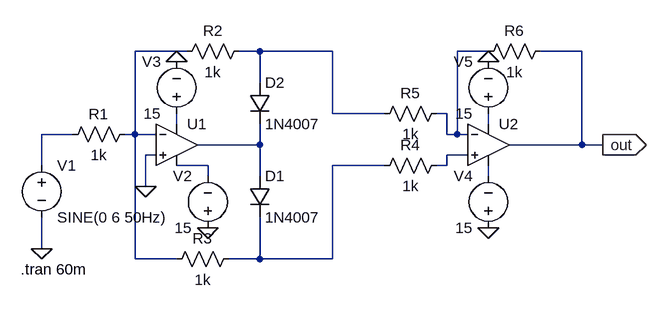
[diagram p0: schematic Day9_Precision_Full_wave_recitifer.asc]
Day9_Precision_Full_wave_recitifer.asc, the LTspice schematic file:
Version 4.1
SHEET 1 880 680
WIRE 80 16 0 16
WIRE 192 16 160 16
WIRE 304 16 192 16
WIRE 544 16 496 16
WIRE 688 16 624 16
WIRE 192 64 192 16
WIRE 304 112 304 16
WIRE 384 112 304 112
WIRE 480 112 464 112
WIRE 64 128 64 112
WIRE 544 128 544 112
WIRE -96 144 -144 144
WIRE 0 144 0 16
WIRE 0 144 -16 144
WIRE 32 144 0 144
WIRE 480 144 480 112
WIRE 496 144 496 16
WIRE 496 144 480 144
WIRE 512 144 496 144
WIRE 192 160 192 128
WIRE 192 160 96 160
WIRE 688 160 688 16
WIRE 688 160 576 160
WIRE 720 160 688 160
WIRE 32 176 16 176
WIRE 512 176 480 176
WIRE -144 192 -144 144
WIRE 112 192 64 192
WIRE 384 192 304 192
WIRE 480 192 480 176
WIRE 480 192 464 192
WIRE 112 208 112 192
WIRE 192 208 192 160
WIRE 544 208 544 192
WIRE 16 224 16 176
WIRE -144 320 -144 272
WIRE 0 336 0 144
WIRE 64 336 0 336
WIRE 192 336 192 272
WIRE 192 336 144 336
WIRE 304 336 304 192
WIRE 304 336 192 336
FLAG 720 160 out
IOPIN 720 160 Out
FLAG 112 288 0
FLAG 64 32 0
FLAG 544 288 0
FLAG 544 32 0
FLAG -144 320 0
FLAG 16 224 0
SYMBOL OpAmps\\UniversalOpAmp2 64 160 R0
SYMATTR InstName U1
SYMBOL voltage -144 176 R0
WINDOW 123 0 0 Left 0
WINDOW 39 0 0 Left 0
SYMATTR InstName V1
SYMATTR Value SINE(0 6 50Hz)
SYMBOL res 0 128 R90
WINDOW 0 0 56 VBottom 2
WINDOW 3 32 56 VTop 2
SYMATTR InstName R1
SYMATTR Value 1k
SYMBOL res 176 0 R90
WINDOW 0 0 56 VBottom 2
WINDOW 3 32 56 VTop 2
SYMATTR InstName R2
SYMATTR Value 1k
SYMBOL diode 176 208 R0
SYMATTR InstName D1
SYMATTR Value 1N4007
SYMBOL OpAmps\\UniversalOpAmp2 544 160 R0
SYMATTR InstName U2
SYMBOL res 480 96 R90
WINDOW 0 0 56 VBottom 2
WINDOW 3 32 56 VTop 2
SYMATTR InstName R5
SYMATTR Value 1k
SYMBOL diode 176 64 R0
SYMATTR InstName D2
SYMATTR Value 1N4007
SYMBOL res 640 0 R90
WINDOW 0 0 56 VBottom 2
WINDOW 3 32 56 VTop 2
SYMATTR InstName R6
SYMATTR Value 1k
SYMBOL voltage 112 304 R180
WINDOW 0 24 96 Left 2
WINDOW 3 24 16 Left 2
WINDOW 123 0 0 Left 0
WINDOW 39 0 0 Left 0
SYMATTR InstName V2
SYMATTR Value 15
SYMBOL voltage 64 128 R180
WINDOW 0 24 96 Left 2
WINDOW 3 24 16 Left 2
WINDOW 123 0 0 Left 0
WINDOW 39 0 0 Left 0
SYMATTR InstName V3
SYMATTR Value 15
SYMBOL voltage 544 304 R180
WINDOW 0 24 96 Left 2
WINDOW 3 24 16 Left 2
WINDOW 123 0 0 Left 0
WINDOW 39 0 0 Left 0
SYMATTR InstName V4
SYMATTR Value 15
SYMBOL voltage 544 128 R180
WINDOW 0 24 96 Left 2
WINDOW 3 24 16 Left 2
WINDOW 123 0 0 Left 0
WINDOW 39 0 0 Left 0
SYMATTR InstName V5
SYMATTR Value 15
SYMBOL res 160 320 R90
WINDOW 0 0 56 VBottom 2
WINDOW 3 32 56 VTop 2
SYMATTR InstName R3
SYMATTR Value 1k
SYMBOL res 480 176 R90
WINDOW 0 0 56 VBottom 2
WINDOW 3 32 56 VTop 2
SYMATTR InstName R4
SYMATTR Value 1k
TEXT -176 352 Left 2 !.tran 60m

The netlist it stands for:
* Day9_Precision_Full_wave_recitifer.asc
X§U1 0 N001 N004 N009 N007 level2 Avol=1Meg GBW=10Meg Slew=10Meg Ilimit=25m Rail=0 Vos=0 En=0 Enk=0 In=0 Ink=0 Rin=500Meg  ; pins In+ In- V+ V- OUT
V1 N006 0 SINE(0 6 50Hz)
R1 N001 N006 1k
R2 N002 N001 1k
D1 N007 N010 1N4007
X§U2 N008 N003 N005 N011 out level2 Avol=1Meg GBW=10Meg Slew=10Meg Ilimit=25m Rail=0 Vos=0 En=0 Enk=0 In=0 Ink=0 Rin=500Meg  ; pins In+ In- V+ V- OUT
R5 N003 N002 1k
D2 N002 N007 1N4007
R6 out N003 1k
V2 0 N009 15
V3 N004 0 15
V4 0 N011 15
V5 N005 0 15
R3 N010 N001 1k
R4 N008 N010 1k
.model D D
.lib standard.dio
.tran 60m
.lib UniversalOpAmp2.lib
.backanno
.end